# EAGLE design VU Meter (EAGLE 6.5.0)
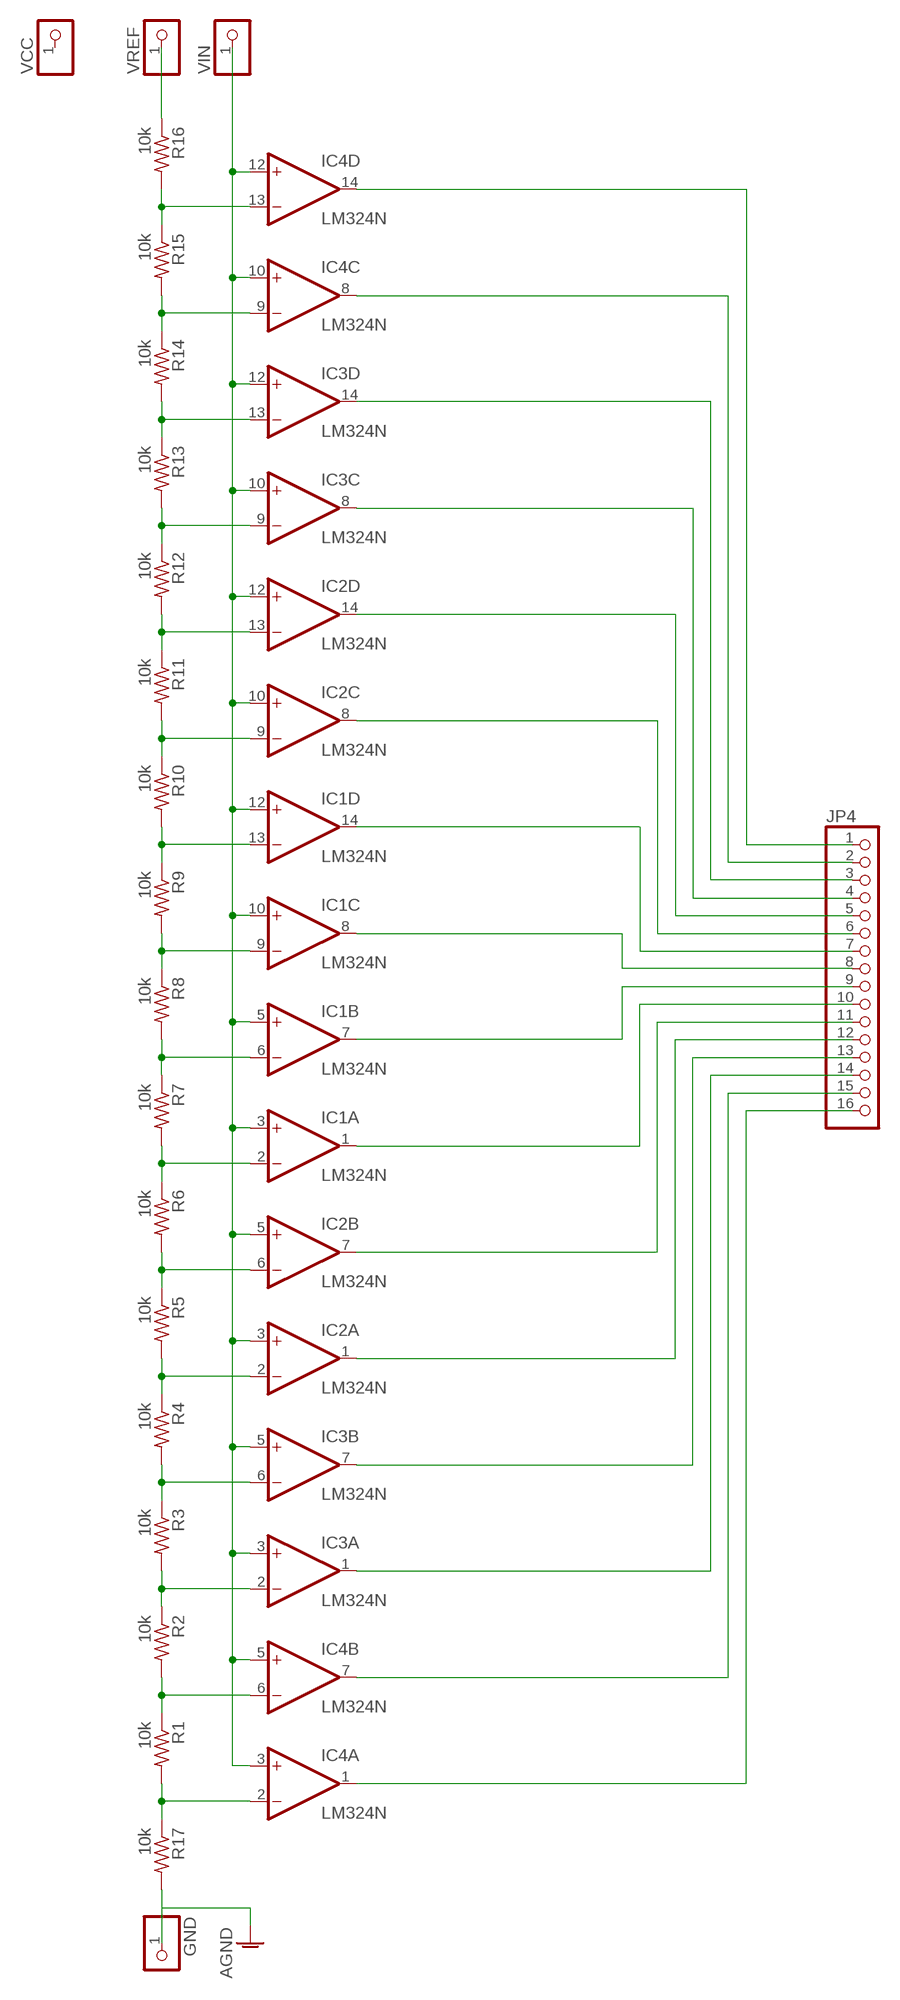
[diagram p0: schematic, sheet 1]

## Parts
GND  PINHD-1X1  [1X01]
IC1  LM324N  [DIL14]
IC2  LM324N  [DIL14]
IC3  LM324N  [DIL14]
IC4  LM324N  [DIL14]
JP4  PINHD-1X16  [1X16]
R1  10k  R-US_0204/7  [0204/7]
R2  10k  R-US_0204/7  [0204/7]
R3  10k  R-US_0204/7  [0204/7]
R4  10k  R-US_0204/7  [0204/7]
R5  10k  R-US_0204/7  [0204/7]
R6  10k  R-US_0204/7  [0204/7]
R7  10k  R-US_0204/7  [0204/7]
R8  10k  R-US_0204/7  [0204/7]
R9  10k  R-US_0204/7  [0204/7]
R10  10k  R-US_0204/7  [0204/7]
R11  10k  R-US_0204/7  [0204/7]
R12  10k  R-US_0204/7  [0204/7]
R13  10k  R-US_0204/7  [0204/7]
R14  10k  R-US_0204/7  [0204/7]
R15  10k  R-US_0204/7  [0204/7]
R16  10k  R-US_0204/7  [0204/7]
R17  10k  R-US_0204/7  [0204/7]
VCC  PINHD-1X1  [1X01]
VIN  PINHD-1X1  [1X01]
VREF  PINHD-1X1  [1X01]

## Nets
AGND: GND.1 R17.2
N$1: IC4.9(C:-IN) R14.1 R15.2
N$2: IC1.3(A:+IN) IC1.5(B:+IN) IC1.10(C:+IN) IC1.12(D:+IN) IC2.3(A:+IN) IC2.5(B:+IN) IC2.10(C:+IN) IC2.12(D:+IN) IC3.3(A:+IN) IC3.5(B:+IN) IC3.10(C:+IN) IC3.12(D:+IN) IC4.3(A:+IN) IC4.5(B:+IN) IC4.10(C:+IN) IC4.12(D:+IN) VIN.1
N$3: IC3.13(D:-IN) R13.1 R14.2
N$4: IC3.9(C:-IN) R12.1 R13.2
N$5: IC2.13(D:-IN) R11.1 R12.2
N$6: IC2.9(C:-IN) R10.1 R11.2
N$7: IC1.13(D:-IN) R9.1 R10.2
N$8: IC4.13(D:-IN) R15.1 R16.2
N$9: IC4.2(A:-IN) R1.2 R17.1
N$10: IC4.6(B:-IN) R1.1 R2.2
N$11: IC3.2(A:-IN) R2.1 R3.2
N$12: IC3.6(B:-IN) R3.1 R4.2
N$13: IC2.2(A:-IN) R4.1 R5.2
N$14: IC2.6(B:-IN) R5.1 R6.2
N$15: IC1.2(A:-IN) R6.1 R7.2
N$16: IC1.6(B:-IN) R7.1 R8.2
N$17: IC1.9(C:-IN) R8.1 R9.2
N$18: R16.1 VREF.1
N$20: IC4.14(D:OUT) JP4.1
N$21: IC4.8(C:OUT) JP4.2
N$22: IC3.14(D:OUT) JP4.3
N$23: IC3.8(C:OUT) JP4.4
N$24: IC2.14(D:OUT) JP4.5
N$25: IC2.8(C:OUT) JP4.6
N$26: IC1.14(D:OUT) JP4.7
N$27: IC1.8(C:OUT) JP4.8
N$28: IC1.7(B:OUT) JP4.9
N$29: IC1.1(A:OUT) JP4.10
N$30: IC2.7(B:OUT) JP4.11
N$31: IC4.1(A:OUT) JP4.16
N$32: IC4.7(B:OUT) JP4.15
N$33: IC3.1(A:OUT) JP4.14
N$34: IC3.7(B:OUT) JP4.13
N$35: IC2.1(A:OUT) JP4.12
Unconnected: VCC.1

## Power pins joined to a net without a drawn wire
AGND: IC1.11(P:V-) IC2.11(P:V-) IC3.11(P:V-) IC4.11(P:V-)
V+: IC1.4(P:V+) IC2.4(P:V+) IC3.4(P:V+) IC4.4(P:V+)

## Library data of the parts
GND VCC VIN VREF = pinhead:PINHD-1X1: PIN HEADER
IC1-IC4 = linear:LM324: OP AMP
JP4 = pinhead:PINHD-1X16: PIN HEADER
R1-R17 = resistor:R-US_: RESISTOR, American symbol

## Board
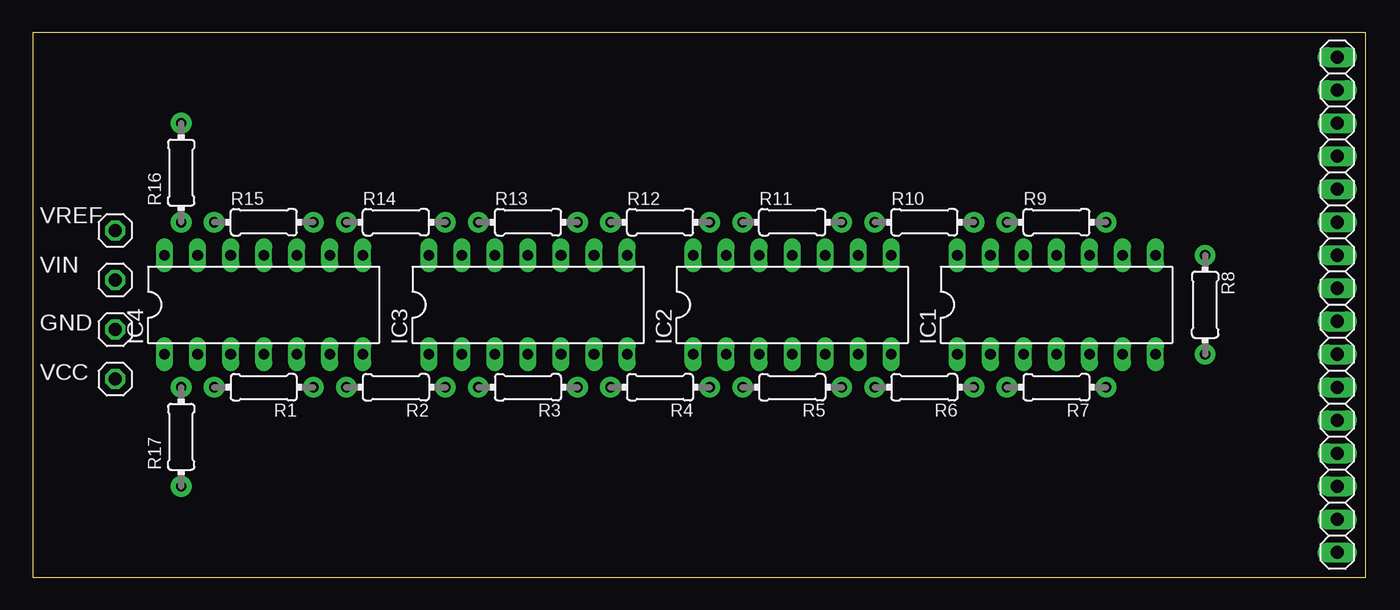
[diagram p1: board, top side]
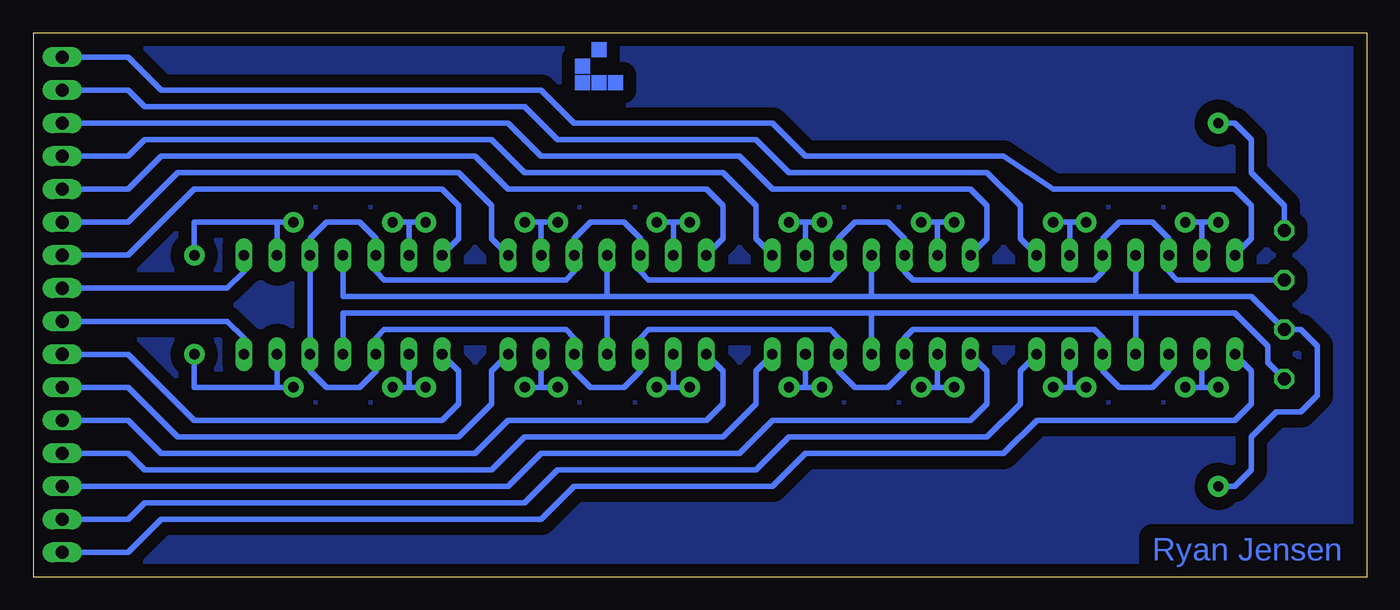
[diagram p2: board, bottom side, seen from below]

Size 102.54 x 41.9 mm. Coordinates in mm from the lower left corner, seen from the top.
Outline: 0,0 102.54,0 102.54,41.9 0,41.9 0,0
Copper layers (1*16): Top 0.035mm / dielectric 1.5mm / Bottom 0.035mm
Design rules "default": minimum track width 10mil, minimum drill 24mil, track to track 8mil, track to pad 8mil, pad to pad 8mil, via to via 8mil, smd to smd 8mil, copper to edge 40mil, drill to drill 8mil, minimum pad ring 10mil, minimum via ring 8mil, stop-mask expansion 4mil, vias tented up to drill 0mil, thermal gap 10mil

### Footprints (pad centres in the part's own frame; a part is rotated, then mirrored left to right if it is on the bottom)
1X01 = drill 1.016 octagon: 1 0,0
DIL14 = drill 0.813 long: 1 -7.62,-3.81; 2 -5.08,-3.81; 3 -2.54,-3.81; 4 0,-3.81; 5 2.54,-3.81; 6 5.08,-3.81; 7 7.62,-3.81; 8 7.62,3.81; 9 5.08,3.81; 10 2.54,3.81; 11 0,3.81; 12 -2.54,3.81; 13 -5.08,3.81; 14 -7.62,3.81
1X16 = drill 1.016 long: 1 -19.05,0; 2 -16.51,0; 3 -13.97,0; 4 -11.43,0; 5 -8.89,0; 6 -6.35,0; 7 -3.81,0; 8 -1.27,0; 9 1.27,0; 10 3.81,0; 11 6.35,0; 12 8.89,0; 13 11.43,0; 14 13.97,0; 15 16.51,0; 16 19.05,0
0204/7 = drill 0.794 pad 1.587: 1 -3.81,0; 2 3.81,0

### Placement (x,y rotation side)
GND  6.35,19.05 0 top
IC1  78.74,20.95 0 top
IC2  58.42,20.95 0 top
IC3  38.1,20.95 0 top
IC4  17.78,20.95 0 top
JP4  100.33,20.95 270 top
R1  17.78,14.61 180 top
R2  27.94,14.61 180 top
R3  38.1,14.61 180 top
R4  48.26,14.61 180 top
R5  58.42,14.61 180 top
R6  68.58,14.61 180 top
R7  78.74,14.61 180 top
R8  90.17,20.95 270 top
R9  78.74,27.3 0 top
R10  68.58,27.3 0 top
R11  58.42,27.3 0 top
R12  48.26,27.3 0 top
R13  38.1,27.3 0 top
R14  27.94,27.3 0 top
R15  17.78,27.3 0 top
R16  11.43,31.11 270 top
R17  11.43,10.79 270 top
VCC  6.35,15.24 0 top
VIN  6.35,22.86 0 top
VREF  6.35,26.67 0 top

### Tracks (layer width: path | path; a pad name or v marks a point on that pad's centre or on a via)
AGND
  Bottom 0.406: IC4.11 17.78,21.59 | 17.78,21.59 38.1,21.59 | 38.1,21.59 IC3.11 | IC2.11 58.42,21.59 | 58.42,21.59 38.1,21.59 | IC1.11 78.74,21.59 58.42,21.59 | 17.78,21.59 8.89,21.59 GND.1 5.08,19.05 3.81,17.78 3.81,13.97 5.08,12.7 6.99,12.7 8.89,10.79 8.89,8.26 10.16,6.99 R17.2
N$1
  Bottom 0.406: R15.2 22.86,27.3 | 22.86,27.3 R14.1 | IC4.9 22.86,27.3
N$2
  Bottom 0.406: IC4.3 15.24,15.88 16.51,14.61 19.05,14.61 20.32,15.88 IC4.5 20.32,18.41 20.95,19.05 34.92,19.05 35.56,18.41 IC3.3 35.56,15.88 36.83,14.61 39.37,14.61 40.64,15.88 IC3.5 40.64,18.41 41.27,19.05 55.24,19.05 55.88,18.41 IC2.3 55.88,15.88 57.15,14.61 59.69,14.61 60.96,15.88 IC2.5 60.96,18.41 61.59,19.05 75.56,19.05 76.2,18.41 IC1.3 76.2,15.88 77.47,14.61 80.01,14.61 81.28,15.88 IC1.5 IC1.10 81.28,26.04 80.01,27.3 77.47,27.3 76.2,26.04 IC1.12 76.2,23.5 75.56,22.86 61.59,22.86 60.96,23.5 IC2.10 60.96,26.04 59.69,27.3 57.15,27.3 55.88,26.04 IC2.12 55.88,23.5 55.24,22.86 41.27,22.86 40.64,23.5 IC3.10 40.64,26.04 39.37,27.3 36.83,27.3 35.56,26.04 IC3.12 35.56,23.5 34.92,22.86 20.95,22.86 20.32,23.5 IC4.10 20.32,26.04 19.05,27.3 16.51,27.3 15.24,26.04 IC4.12 15.24,23.5 14.61,22.86 VIN.1
N$3
  Bottom 0.406: R14.2 33.02,27.3 | 33.02,27.3 R13.1 | IC3.13 33.02,27.3
N$4
  Bottom 0.406: IC3.9 43.18,27.3 | 43.18,27.3 R13.2 | R12.1 43.18,27.3
N$5
  Bottom 0.406: IC2.13 53.34,27.3 | 53.34,27.3 R12.2 | R11.1 53.34,27.3
N$6
  Bottom 0.406: R10.1 63.5,27.3 | 63.5,27.3 R11.2 | IC2.9 63.5,27.3
N$7
  Bottom 0.406: R10.2 73.66,27.3 | 73.66,27.3 R9.1 | IC1.13 73.66,27.3
N$8
  Bottom 0.406: R16.2 12.7,27.3 | 12.7,27.3 R15.1 | IC4.13 12.7,27.3
N$9
  Bottom 0.406: R17.1 R1.2 12.7,14.61 IC4.2
N$10
  Bottom 0.406: R1.1 22.86,14.61 | 22.86,14.61 R2.2 | IC4.6 22.86,14.61
N$11
  Bottom 0.406: R2.1 33.02,14.61 | 33.02,14.61 R3.2 | IC3.2 33.02,14.61
N$12
  Bottom 0.406: R3.1 43.18,14.61 | 43.18,14.61 R4.2 | IC3.6 43.18,14.61
N$13
  Bottom 0.406: R5.2 53.34,14.61 | 53.34,14.61 R4.1 | IC2.2 53.34,14.61
N$14
  Bottom 0.406: R6.2 63.5,14.61 | 63.5,14.61 R5.1 | IC2.6 63.5,14.61
N$15
  Bottom 0.406: R7.2 73.66,14.61 | 73.66,14.61 R6.1 | IC1.2 73.66,14.61
N$16
  Bottom 0.406: R7.1 83.82,14.61 | 83.82,14.61 IC1.6 | R8.2 90.17,14.61 83.82,14.61
N$17
  Bottom 0.406: R9.2 83.82,27.3 | 83.82,27.3 IC1.9 | R8.1 90.17,27.3 83.82,27.3
N$18
  Bottom 0.406: R16.1 10.16,34.92 8.89,33.66 8.89,31.11 6.35,28.57 VREF.1
N$19
  pour Bottom (isolate 1.016): 0,41.91 0,0 102.87,0 102.87,41.91
N$20
  Bottom 0.406: JP4.1 95.25,40.01 92.71,37.47 63.5,37.47 60.96,34.92 45.72,34.92 43.18,32.38 27.94,32.38 24.13,29.84 10.16,29.84 8.89,28.57 8.89,26.04 IC4.14
N$21
  Bottom 0.406: JP4.2 95.25,37.47 93.98,36.2 64.77,36.2 62.23,33.66 46.99,33.66 44.45,31.11 29.21,31.11 26.67,28.57 26.67,26.04 IC4.8
N$22
  Bottom 0.406: JP4.3 66.04,34.92 63.5,32.38 48.26,32.38 45.72,29.84 30.48,29.84 29.21,28.57 29.21,26.04 IC3.14
N$23
  Bottom 0.406: JP4.4 95.25,32.38 93.98,33.66 67.31,33.66 64.77,31.11 49.53,31.11 46.99,28.57 46.99,26.04 IC3.8
N$24
  Bottom 0.406: JP4.5 95.25,29.84 92.71,32.38 68.58,32.38 66.04,29.84 50.8,29.84 49.53,28.57 49.53,26.04 IC2.14
N$25
  Bottom 0.406: JP4.6 95.25,27.3 91.44,31.11 69.85,31.11 67.31,28.57 67.31,26.04 IC2.8
N$26
  Bottom 0.406: JP4.7 95.25,24.77 90.17,29.84 71.12,29.84 69.85,28.57 69.85,26.04 IC1.14
N$27
  Bottom 0.406: IC1.8 86.36,23.5 87.63,22.23 JP4.8
N$28
  Bottom 0.406: IC1.7 86.36,18.41 87.63,19.68 JP4.9
N$29
  Bottom 0.406: IC1.1 69.85,15.88 69.85,13.34 71.12,12.06 90.17,12.06 95.25,17.14 JP4.10
N$30
  Bottom 0.406: IC2.7 67.31,15.88 67.31,13.34 69.85,10.79 91.44,10.79 95.25,14.61 JP4.11
N$31
  Bottom 0.406: JP4.16 95.25,1.91 92.71,4.45 63.5,4.45 60.96,6.99 45.72,6.99 43.18,9.53 27.94,9.53 25.4,12.06 10.16,12.06 8.89,13.34 8.89,15.88 IC4.1
N$32
  Bottom 0.406: IC4.7 26.67,15.88 26.67,13.34 29.21,10.79 44.45,10.79 46.99,8.26 62.23,8.26 64.77,5.71 93.98,5.71 95.25,4.45 JP4.15
N$33
  Bottom 0.406: JP4.14 66.04,6.99 63.5,9.53 48.26,9.53 45.72,12.06 30.48,12.06 29.21,13.34 29.21,15.88 IC3.1
N$34
  Bottom 0.406: IC3.7 46.99,15.88 46.99,13.34 49.53,10.79 64.77,10.79 67.31,8.26 93.98,8.26 95.25,9.53 JP4.13
N$35
  Bottom 0.406: JP4.12 95.25,12.06 92.71,9.53 68.58,9.53 66.04,12.06 50.8,12.06 49.53,13.34 49.53,15.88 IC2.1
V+
  Bottom 0.406: IC1.4 78.74,20.32 58.42,20.32 | IC2.4 58.42,20.32 | 58.42,20.32 38.1,20.32 | IC3.4 38.1,20.32 | 38.1,20.32 17.78,20.32 | 17.78,20.32 IC4.4 | 17.78,20.32 10.16,20.32 7.62,17.78 7.62,16.51 6.35,15.24
(copper drawn outside any net)
  shapes: Bottom area x5

### Text on the board
Bottom: Ryan Jensen
Unrouted: Analog to Digital VU Meter v2 | 16 | 2014 | Digital VU Meter Out | 1